# Altium schematic sheet Power.SchDoc
size A4; SheetNumber: 4; SheetTotal: 4
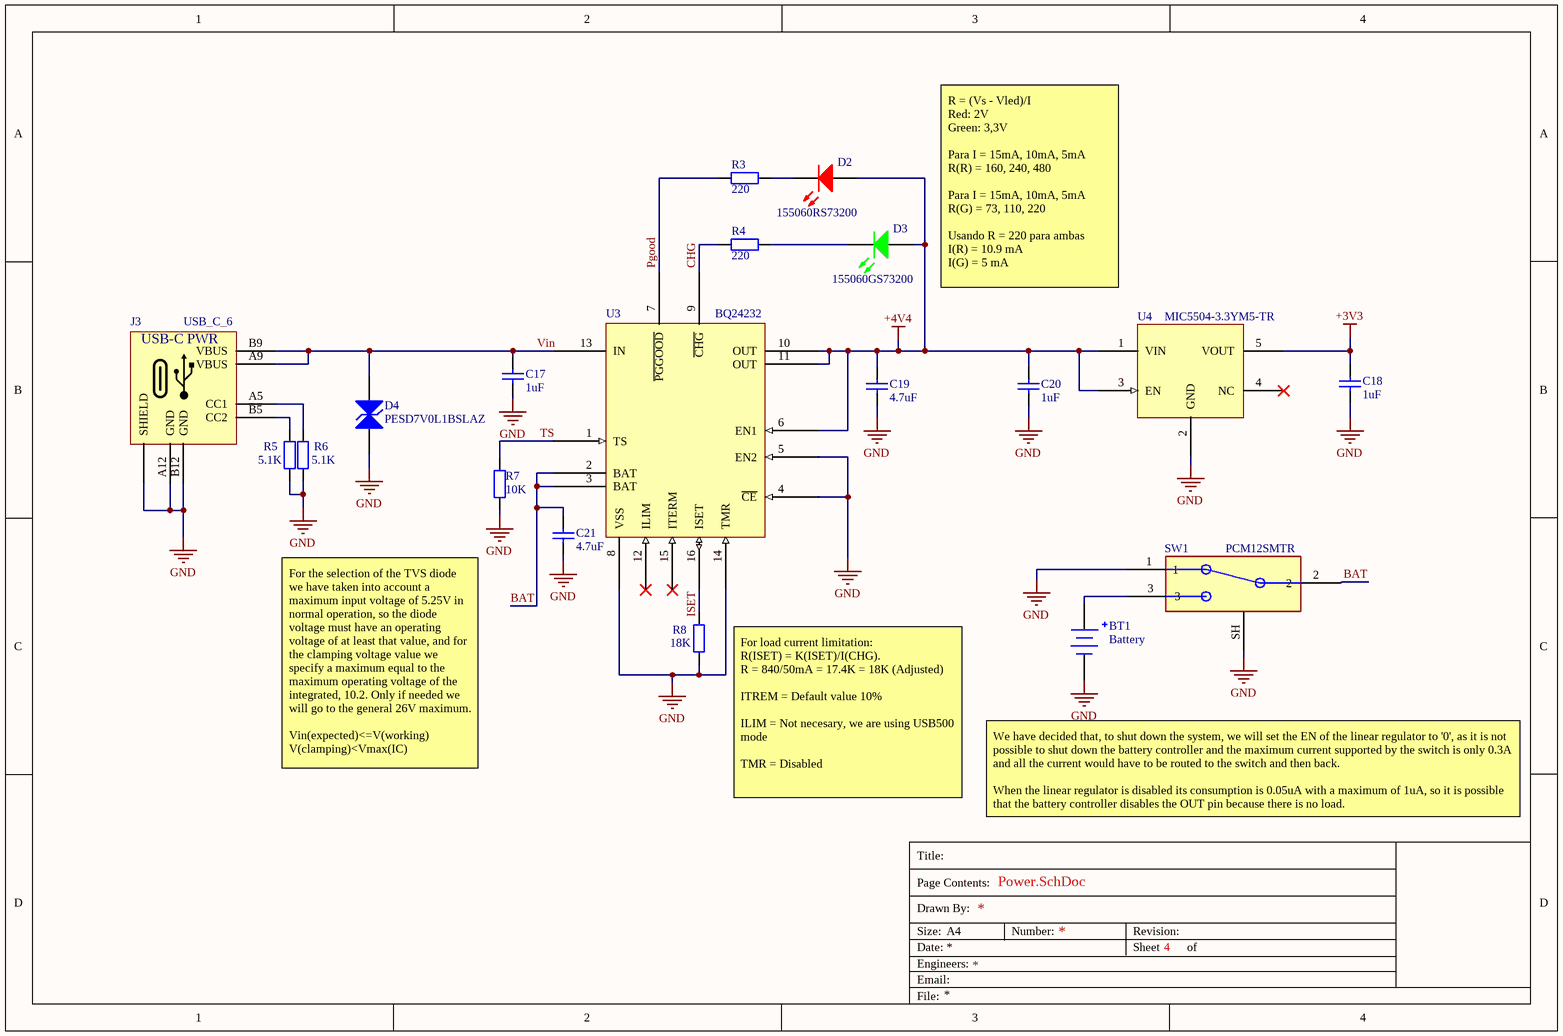
[diagram p0: Power.SchDoc]

## Parts
BT1  Battery  [Hand solder wire polarity]
C17  1uF  [C0402]
C18  1uF  [C0402]
C19  4.7uF  [C0402]
C20  1uF  [C0402]
C21  4.7uF  [C0402]
D2  155060RS73200  [LED_Side_0603]
D3  155060GS73200  [LED_Side_0603]
D4  PESD7V0L1BSLAZ  [DFN1006-2/SOD882]
J3  USB_C_6  [USB4135-GF-A]
R3  220  [R0402]
R4  220  [R0402]
R5  5.1K  [R0402]
R6  5.1K  [R0402]
R7  10K  [R0402]
R8  18K  [R0402]
SW1  PCM12SMTR  [PCM12SMTR]
U3  BQ24232  [QFN50P300X300X100_HS-17N]
U4  MIC5504-3.3YM5-TR  [SOT23-5]

## Nets
+3V3: C18.1 U4.5(VOUT)
+4V4: C19.1 C20.1 D2.1(A) D3.1(A) U3.6(EN1) U3.10(OUT) U3.11(OUT) U4.1(VIN) U4.3(EN)
GND: BT1.2(-) C17.2 C18.2 C19.2 C20.2 C21.2 D4.1(A) J3.A12(GND) J3.B12(GND) J3.SHIELD R5.1 R6.1 R7.2 R8.1 SW1.1 SW1.SH U3.4(~{CE}) U3.5(EN2) U3.8(VSS) U3.14(TMR) U4.2(GND)
BAT: C21.1 SW1.2 U3.2(BAT) U3.3(BAT)
CHG: R4.2 U3.9(~{CHG})
ISET: R8.2 U3.16(ISET)
Pgood: R3.2 U3.7(~{PGGOOD})
TS: R7.1 U3.1(TS)
Vin: C17.1 D4.2(K) J3.A9(VBUS) J3.B9(VBUS) U3.13(IN)
NetBT1_1: BT1.1(+) SW1.3
NetD2_2: D2.2(K) R3.1
NetD3_2: D3.2(K) R4.1
NetJ3_A5: J3.A5(CC1) R6.2
NetJ3_B5: J3.B5(CC2) R5.2

Not connected (* = marked no-connect by the designer): U3 12(ILIM)* 15(ITERM)*; U4 4(NC)*

## Notes on the sheet
- R = (Vs - Vled)/I
  Red: 2V
  Green: 3,3V
  Para I = 15mA, 10mA, 5mA
  R(R) = 160, 240, 480
  Para I = 15mA, 10mA, 5mA
  R(G) = 73, 110, 220
  Usando R = 220 para ambas
  I(R) = 10.9 mA
  I(G) = 5 mA
- For the selection of the TVS diode we have taken into account a maximum input voltage of 5.25V in normal operation, so the diode voltage must have an operating voltage of at least that value, and for the clamping voltage value we specify a maximum equal to the maximum operating voltage of the integrated, 10.2. Only if needed we will go to the general 26V maximum.
  Vin(expected)<=V(working)
  V(clamping)<Vmax(IC)
- (near R8) For load current limitation:
  R(ISET) = K(ISET)/I(CHG).
  R = 840/50mA = 17.4K = 18K (Adjusted)
  ITREM = Default value 10%
  ILIM = Not necesary, we are using USB500 mode
  TMR = Disabled
- We have decided that, to shut down the system, we will set the EN of the linear regulator to '0', as it is not possible to shut down the battery controller and the maximum current supported by the switch is only 0.3A and all the current would have to be routed to the switch and then back.
  When the linear regulator is disabled its consumption is 0.05uA with a maximum of 1uA, so it is possible that the battery controller disables the OUT pin because there is no load.
- Title:
- Drawn By:
- Page Contents:
- Size:
- Date:
- File:
- Engineers:
- Email:
- A4
- Number:
- Revision:
- Sheet
- of
- (in symbol USB_C_6) USB-C PWR

## Library data of the parts
BT1 = Battery: Multicell Battery
C17 C18 C20 C21 = C: Capacitor
C19 = C: Capacitor; Voltage: >10V
D2 = LED_R: Red LED
D3 = LED_G: Green LED
D4 = D Zener_Bidirectional: Zener Diode Bidirectional
J3 = USB_C_6: USB-C 6 pin connector for power only. 20V/3A
R3-R8 = R: Resistor
U3 = BQ24232: Power management IC. USB-Friendly Lithium-Ion Battery Charger And Power-Path Management IC